# Altium schematic sheet Boost_converter.SchDoc
size A4
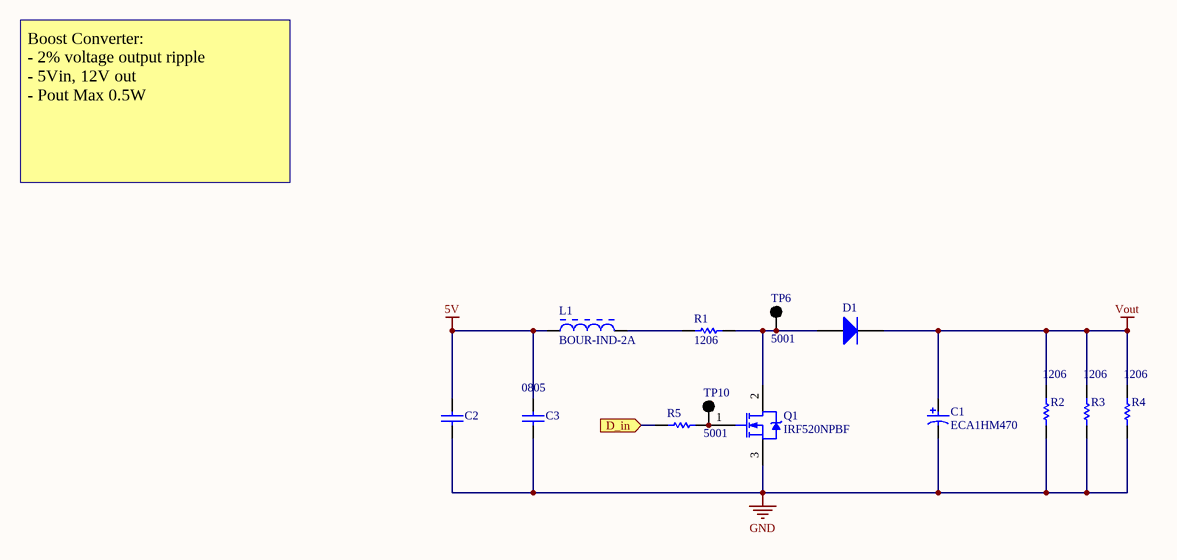
[diagram p0: Boost_converter.SchDoc]

## Parts
C1  ECA1HM470  [CAPPR55-250-1120X630X1220]
C2  CAP 0.5pF 50V 0805(2012)  [CAPC0805(2012)75_M]  (value not drawn)
C3  Case-EIA: 0805  [CAPC0805(2012)75_M]  (hidden comment: CAP 0.5pF 50V 0805(2012))
D1  (no value)  [DIOD-S1M-13-F-SMA-2_V]
L1  BOUR-IND-2A  [SRR1208 Inductor]
Q1  IRF520NPBF  [INTR-TO-220AB-3]
R1  Case-EIA: 1206  [RESC1206(3216)_M]  (hidden comment: 1K43 1% 1206(3216))
R2  Case-EIA: 1206  [RESC1206(3216)_M]  (hidden comment: 1K43 1% 1206(3216))
R3  Case-EIA: 1206  [RESC1206(3216)_M]  (hidden comment: 1K43 1% 1206(3216))
R4  Case-EIA: 1206  [RESC1206(3216)_M]  (hidden comment: 1K43 1% 1206(3216))
R5  1K43 1% 1206(3216)  [RESC1206(3216)_M]  (value not drawn)
TP6  5001  [KSTN-5001]
TP10  5001  [KSTN-5001]

## Ports
D_in (in)

## Nets
5V: C2.2 C3.2 L1.1
GND: C1.2 C2.1 C3.1 Q1.3(S) R2.1 R3.1 R4.1
Vout: C1.1 D1.2(K) R2.2 R3.2 R4.2
D_in: R5.2 ; port D_in
NetD1_1: D1.1(A) Q1.2(D) R1.1 TP6.1
NetL1_2: L1.2 R1.2
NetQ1_1: Q1.1(G) R5.1 TP10.1

## Notes on the sheet
- Boost Converter:
  - 2% voltage output ripple
  - 5Vin, 12V out
  - Pout Max 0.5W

## Library data of the parts
C1 = CMP-2100-03626-1: Aluminum Electrolytic Capacitor, 47 uF, +/- 20%, 50 V, -40 to 85 degC, 2-Pin THD, RoHS, Bulk; Manufacturer: Panasonic; Voltage Rating: 50V; Ripple Current: 130mA; Dissipation Factor: 0.12%; Capacitance: 47uF; Lead Diameter: 0.5mm; Lead/Base Style: Straight; Life (Hours): 2000Hour; Leakage Current: 3uA; Diameter: 6.3mm; REACH SVHC: NoSVHC; Mount: ThroughHole; Package Reference: CAPPR55-250-1120X630X1220; Package Quantity: 200; Case/Package: Radial; Voltage Rating (DC): 50V; Packaging: Bulk; Length: 11.2mm; Manufacturer URL: http://www.panasonic.com/; Datasheet URL: https://industrial.panasonic.com/cdbs/www-data/pdf/RDF0000/ABA0000C1218.pdf; Height: 11.2mm; Package Description: 2-Pin Radial Lead, Dia 6.3 mm, Height 12.2 mm; Min Operating Temperature: -40degC; Tolerance: 20%; Datasheet Version: Rev. 05, 10/2016; RoHSCompliant: true; Termination: Radial; Voltage: 50V; Radiation Hardening: No; Height - Seated (Max): 0.48inch; Max Operating Temperature: 85degC; Lead Pitch: 2.5mm
C2 = CMP-1036-00018-1: CAP 0.5pF 50V ±0.1pF 0805 (2012 Metric) Thickness 0.75mm SMD; Case-EIA: 0805; Case-Metric: 2012; Tolerance: Â±0.1pF; Value: 0.5pF; Technology: SMT; Rated Voltage: 50 V; Max Thickness: 0.75 mm
C3 = CMP-1036-00018-1: CAP 0.5pF 50V ±0.1pF 0805 (2012 Metric) Thickness 0.75mm SMD; Case-Metric: 2012; Tolerance: Â±0.1pF; Value: 0.5pF; Technology: SMT; Rated Voltage: 50 V; Max Thickness: 0.75 mm
D1 = CMP-0639-00001-1: Surface Mount Glass Passivated Rectifier, 1000V, 1 A, -65 to 125 degC, 2-Pin SMA Package, RoHS, Tape and Reel; Manufacturer: Diodes Inc; PartNumber: S1M-13-F; Maximum Reverse Current IR (uA): 5; Maximum Peak Forward Surge Current IFSM (A): 30; Maximum Average Rectified Current IO (A): 1; Peak Repetitive Reverse Voltage VRRM (V): 1000; Total Capacitance CT (pF): 10; Forward Voltage Drop VF (V): 1.1; ComponentLink1URL: http://www.diodes.com/; Operating Temperature Range: -65 to 150 degC; ComponentLink3URL: http://diodes.com/datasheets/ds16003.pdf; ComponentLink3Description: Package Specification; PackageDescription: 2-Pin SMD, Body 4.3 x 2.605 mm, Height 2.3 mm; Mounting Technology: Surface Mount; ComponentLink1Description: Manufacturer URL; PackageReference: S1M-13-F-SMA-2; ComponentLink2URL: http://diodes.com/datasheets/ds16003.pdf; ComponentLink2Description: Datasheet; RoHS: TRUE; DatasheetVersion: Rev. 22 - 2; Packing: Tape and Reel; PackageVersion: Rev. 22 - 2
L1 = BOUR-IND-2A: Manufacturer PN: SRR1208-272KLTR-ND; Inductance: 2.7mH
Q1 = CMP-2100-03647-1: HEXFET(R) Power MOSFET, 100 V, 9.7 A, 0.2 Ohm, -55 to 175 degC, 3-Pin FM (TO-220AB), RoHS, Tube; Manufacturer: International Rectifier; Element Configuration: Single; Rds On Max: 200mOhm; Drain to Source Voltage (Vdss): 100V; Number of Elements: 1; Continuous Drain Current (ID): 9.7A; Input Capacitance: 330pF; Gate to Source Voltage (Vgs): 20V; Power Dissipation: 48W; Rise Time: 23ns; Turn-Off Delay Time: 32ns; Turn-On Delay Time: 4.5ns; Datasheet URL: http://www.infineon.com/dgdl/irf520npbf.pdf?fileId=5546d462533600a4015355e340711985; Max Operating Temperature: 175degC; Height: 15.24mm; RoHSCompliant: true; Package Description: 3-Pin Flange Mount, Body 4.445 x 10.415 mm, Pitch 2.54 mm; Manufacturer URL: http://internationalrectifier.com/; Length: 10.54mm; Mount: ThroughHole; Lead Free: LeadFree; Drain to Source Resistance: 200mOhm; Drain to Source Breakdown Voltage: 100V; Number of Pins: 3; Case/Package: TO-220AB; Package Quantity: 50; Lead Pitch: 2.54mm; REACH SVHC: NoSVHC; Package Reference: TO-220AB; Radiation Hardening: No; Packaging: Rail/Tube; Min Operating Temperature: -55degC; Width: 4.69mm; Fall Time: 23ns; Max Power Dissipation: 48W; Datasheet Version: 37926.0; Voltage Rating (DC): 100V; Current Rating: 9.7A
R1-R4 = CMP-1014-00526-1: 1K43 0.25W 1% 1206 (3216 Metric)  SMD; Value: 1430.00 Ohm; Case-Metric: 3216; Power: 0.25 W; Technology: SMT; Tolerance: 1 %
R5 = CMP-1014-00526-1: 1K43 0.25W 1% 1206 (3216 Metric)  SMD; Value: 1430.00 Ohm; Case-EIA: 1206; Case-Metric: 3216; Power: 0.25 W; Technology: SMT; Tolerance: 1 %
TP6 TP10 = CMP-2000-05181-1: Test Point, Black, 1-Pin THD, RoHS, Bulk; Manufacturer: Keystone; Other Names: 5001K; Catalog Drawings: 5000Series; Kits: DKTGRS232C-KIT-ND / -TTLCONVERTER; Online Catalog: ColorCodedTestPoints; Datasheet URL: https://ciiva.com/datasheet-click-2917627?src=ciiva&sig=bd195616; Family: TestPoints; RoHS Information: RoHSComplianceStatement; Datasheet Version: Rev. G, 12/2008; Color: Black; Category: TestandMeasurement; Standard Package: 100; Manufacturer URL: http://www.keyelco.com/; Material: Base,Nylon46,UL94V-0; Type: PCTestPoint,Miniature; Series: THM; Packaging: Bulk